# EAGLE schematic control board (EAGLE 7.6.0)
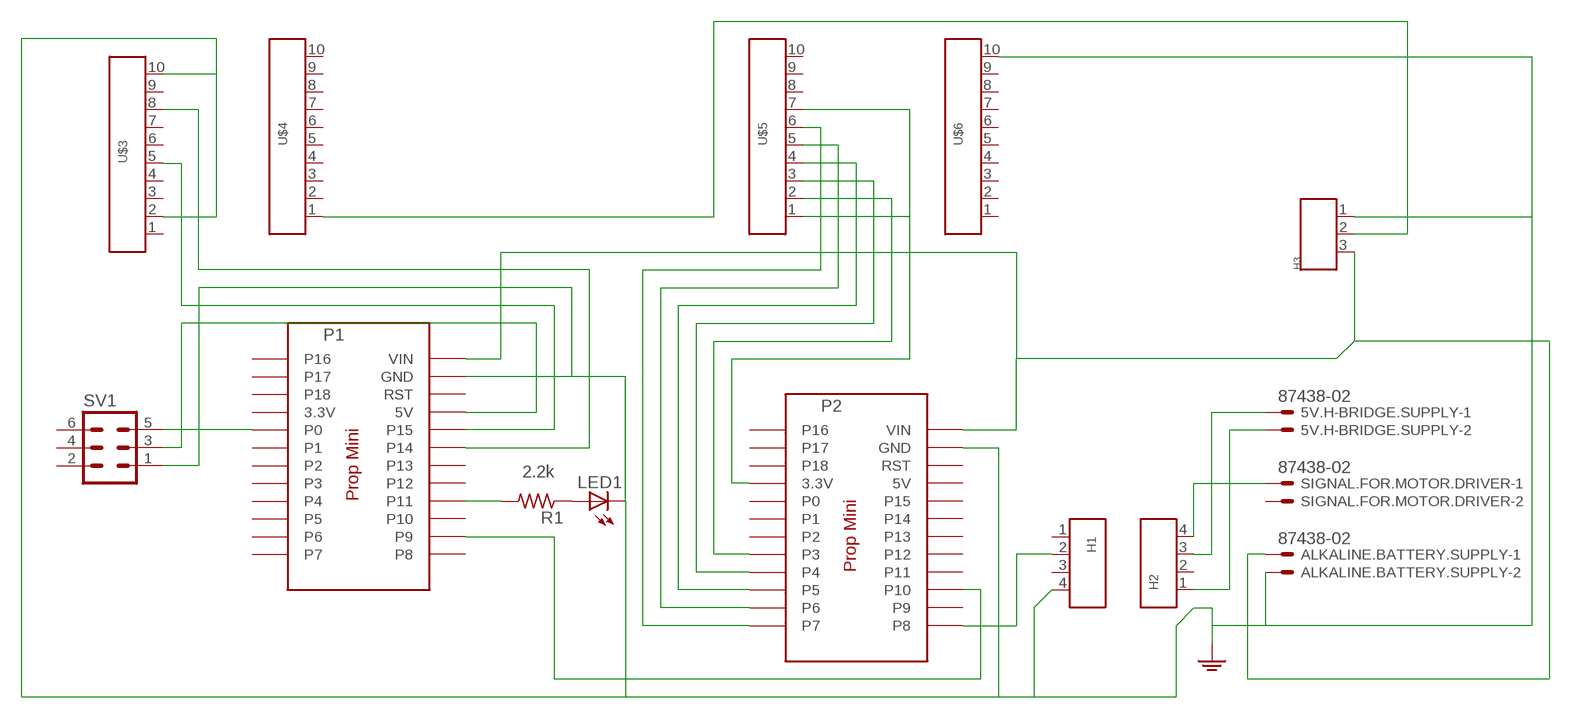
[diagram p0: schematic, sheet 1]

## Parts
5V.H-BRIDGE.SUPPLY  87438-02  [87438-02]
ALKALINE.BATTERY.SUPPLY  87438-02  [87438-02]
H1  1X04  [DIP0.1-1X04]
H2  1X04  [DIP0.1-1X04]
H3  1X03  [DIP0.1-1X03]
LED1  LED3MM  [LED3MM]
P1  PROP-MINI  [PROP-MINI]
P2  PROP-MINI  [PROP-MINI]
R1  R0603  [0603]
SIGNAL.FOR.MOTOR.DRIVER  87438-02  [87438-02]
SV1  MA03-2  [MA03-2]
U$3  1X10  [DIP0.1-1X10]
U$4  1X10  [DIP0.1-1X10]
U$5  1X10  [DIP0.1-1X10]
U$6  1X10  [DIP0.1-1X10]

## Nets
GND: ALKALINE.BATTERY.SUPPLY.2 H1.4 H3.1 P2.GND U$3.2 U$3.10 U$6.10
N$1: P1.P9 P2.P10
N$2: P1.P11 R1.2
N$3: LED1.A R1.1
N$4: LED1.K(C) P1.GND SV1.1
N$5: P1.P14 U$3.8
N$6: P1.P15 U$3.5
N$7: P1.5V SV1.3
N$8: H2.4 SIGNAL.FOR.MOTOR.DRIVER.1
N$9: P2.P6 U$5.5
N$10: P1.P0 SV1.5
N$11: P2.P7 U$5.6
N$12: P2.P5 U$5.4
N$13: P2.P4 U$5.3
N$14: P2.P3 U$5.2
N$15: P2.3.3V U$5.1 U$5.7
N$16: 5V.H-BRIDGE.SUPPLY.2 H2.1
N$17: 5V.H-BRIDGE.SUPPLY.1 H2.3
N$18: H3.2 U$4.1
N$19: H1.2 P2.P8
N$20: ALKALINE.BATTERY.SUPPLY.1 H3.3 P1.VIN P2.VIN
Unconnected: H1.1 H1.3 H2.2 P1.3.3V P1.P1 P1.P2 P1.P3 P1.P4 P1.P5 P1.P6 P1.P7 P1.P8 P1.P10 P1.P12 P1.P13 P1.P16 P1.P17 P1.P18 P1.RST P2.5V P2.P0 P2.P1 P2.P2 P2.P9 P2.P11 P2.P12 P2.P13 P2.P14 P2.P15 P2.P16 P2.P17 P2.P18 P2.RST SIGNAL.FOR.MOTOR.DRIVER.2 SV1.2 SV1.4 SV1.6 U$3.1 U$3.3 U$3.4 U$3.6 U$3.7 U$3.9 U$4.2 U$4.3 U$4.4 U$4.5 U$4.6 U$4.7 U$4.8 U$4.9 U$4.10 U$5.8 U$5.9 U$5.10 U$6.1 U$6.2 U$6.3 U$6.4 U$6.5 U$6.6 U$6.7 U$6.8 U$6.9

## Library data of the parts
5V.H-BRIDGE.SUPPLY ALKALINE.BATTERY.SUPPLY SIGNAL.FOR.MOTOR.DRIVER = con-molex:87438-02: Wire-to-Board 1.50mm (.059") Pitch Header - Right Angle, SMT, Shrouded Source: http://www.molex.com/product/micro/87438.html; OC_FARNELL: 1711327; OC_NEWARK: unknown
H1 H2 = headers:1X04
H3 = headers:1X03
LED1 = led:LED: LED OSRAM: - CHIPLED LG R971, LG N971, LY N971, LG Q971, LY Q971, LO R971, LY R971 LH N974, LH R974 LS Q976, LO Q976, LY Q976 LO Q996 - Hyper CHIPLED LW Q18S LB Q993, LB Q99A, LB R99A - SideLED LS A670, LO A670, LY A670, LG A670, LP A670 LB A673, LV A673, LT A673, LW A673 LH A674 LY A675 LS A676, LA A676, LO A676, LY A676, LW A676 LS A679, LY A679, LG A679 - Hyper Micro SIDELED® LS Y876, LA Y876, LO Y876, LY Y876 LT Y87S - SmartLED LW L88C, LW L88S LB L89C, LB L89S, LG L890 LS L89K, LO L89K, LY L89K LS L896, LA L896, LO L896, LY L896 - TOPLED LS T670, LO T670, LY T670, LG T670, LP T670 LSG T670, LSP T670, LSY T670, LOP T670, LYG T670 LG T671, LOG T671, LSG T671 LB T673, LV T673, LT T673, LW T673 LH T674 LS T676, LA T676, LO T676, LY T676, LB T676, LH T676, LSB T676, LW T676 LB T67C, LV T67C, LT T67C, LS T67K, LO T67K, LY T67K, LW E67C LS E67B, LA E67B, LO E67B, LY E67B, LB E67C, LV E67C, LT E67C LW T67C LS T679, LY T679, LG T679 LS T770, LO T770, LY T770, LG T770, LP T770 LB T773, LV T773, LT T773, LW T773 LH T774 LS E675, LA E675, LY E675, LS T675 LS T776, LA T776, LO T776, LY T776, LB T776 LHGB T686 LT T68C, LB T68C - Hyper Mini TOPLED® LB M676 - Mini TOPLED Santana® LG M470 LS M47K, LO M47K, LY M47K Source: http://www.osram.convergy.de LUXEON: - LUMILED® LXK2-PW12-R00, LXK2-PW12-S00, LXK2-PW14-U00, LXK2-PW14-V00 LXK2-PM12-R00, LXK2-PM12-S00, LXK2-PM14-U00 LXK2-PE12-Q00, LXK2-PE12-R00, LXK2-PE12-S00, LXK2-PE14-T00, LXK2-PE14-U00 LXK2-PB12-K00, LXK2-PB12-L00, LXK2-PB12-M00, LXK2-PB14-N00, LXK2-PB14-P00, LXK2-PB14-Q00 LXK2-PR12-L00, LXK2-PR12-M00, LXK2-PR14-Q00, LXK2-PR14-R00 LXK2-PD12-Q00, LXK2-PD12-R00, LXK2-PD12-S00 LXK2-PH12-R00, LXK2-PH12-S00 LXK2-PL12-P00, LXK2-PL12-Q00, LXK2-PL12-R00 Source: www.luxeon.com KINGBRIGHT: KA-3528ASYC Source: www.kingbright.com
P1 P2 = Microcontrollers:PROP-MINI
R1 = RCL:R; R1: 2.2k
SV1 = con-lstb:MA03-2: PIN HEADER; OC_FARNELL: unknown; OC_NEWARK: unknown
U$3-U$6 = headers:1X10; DIP: 0.1